# Altium schematic sheet EvoProject 1.0 - Entradas e Saídas.SchDoc
size A3
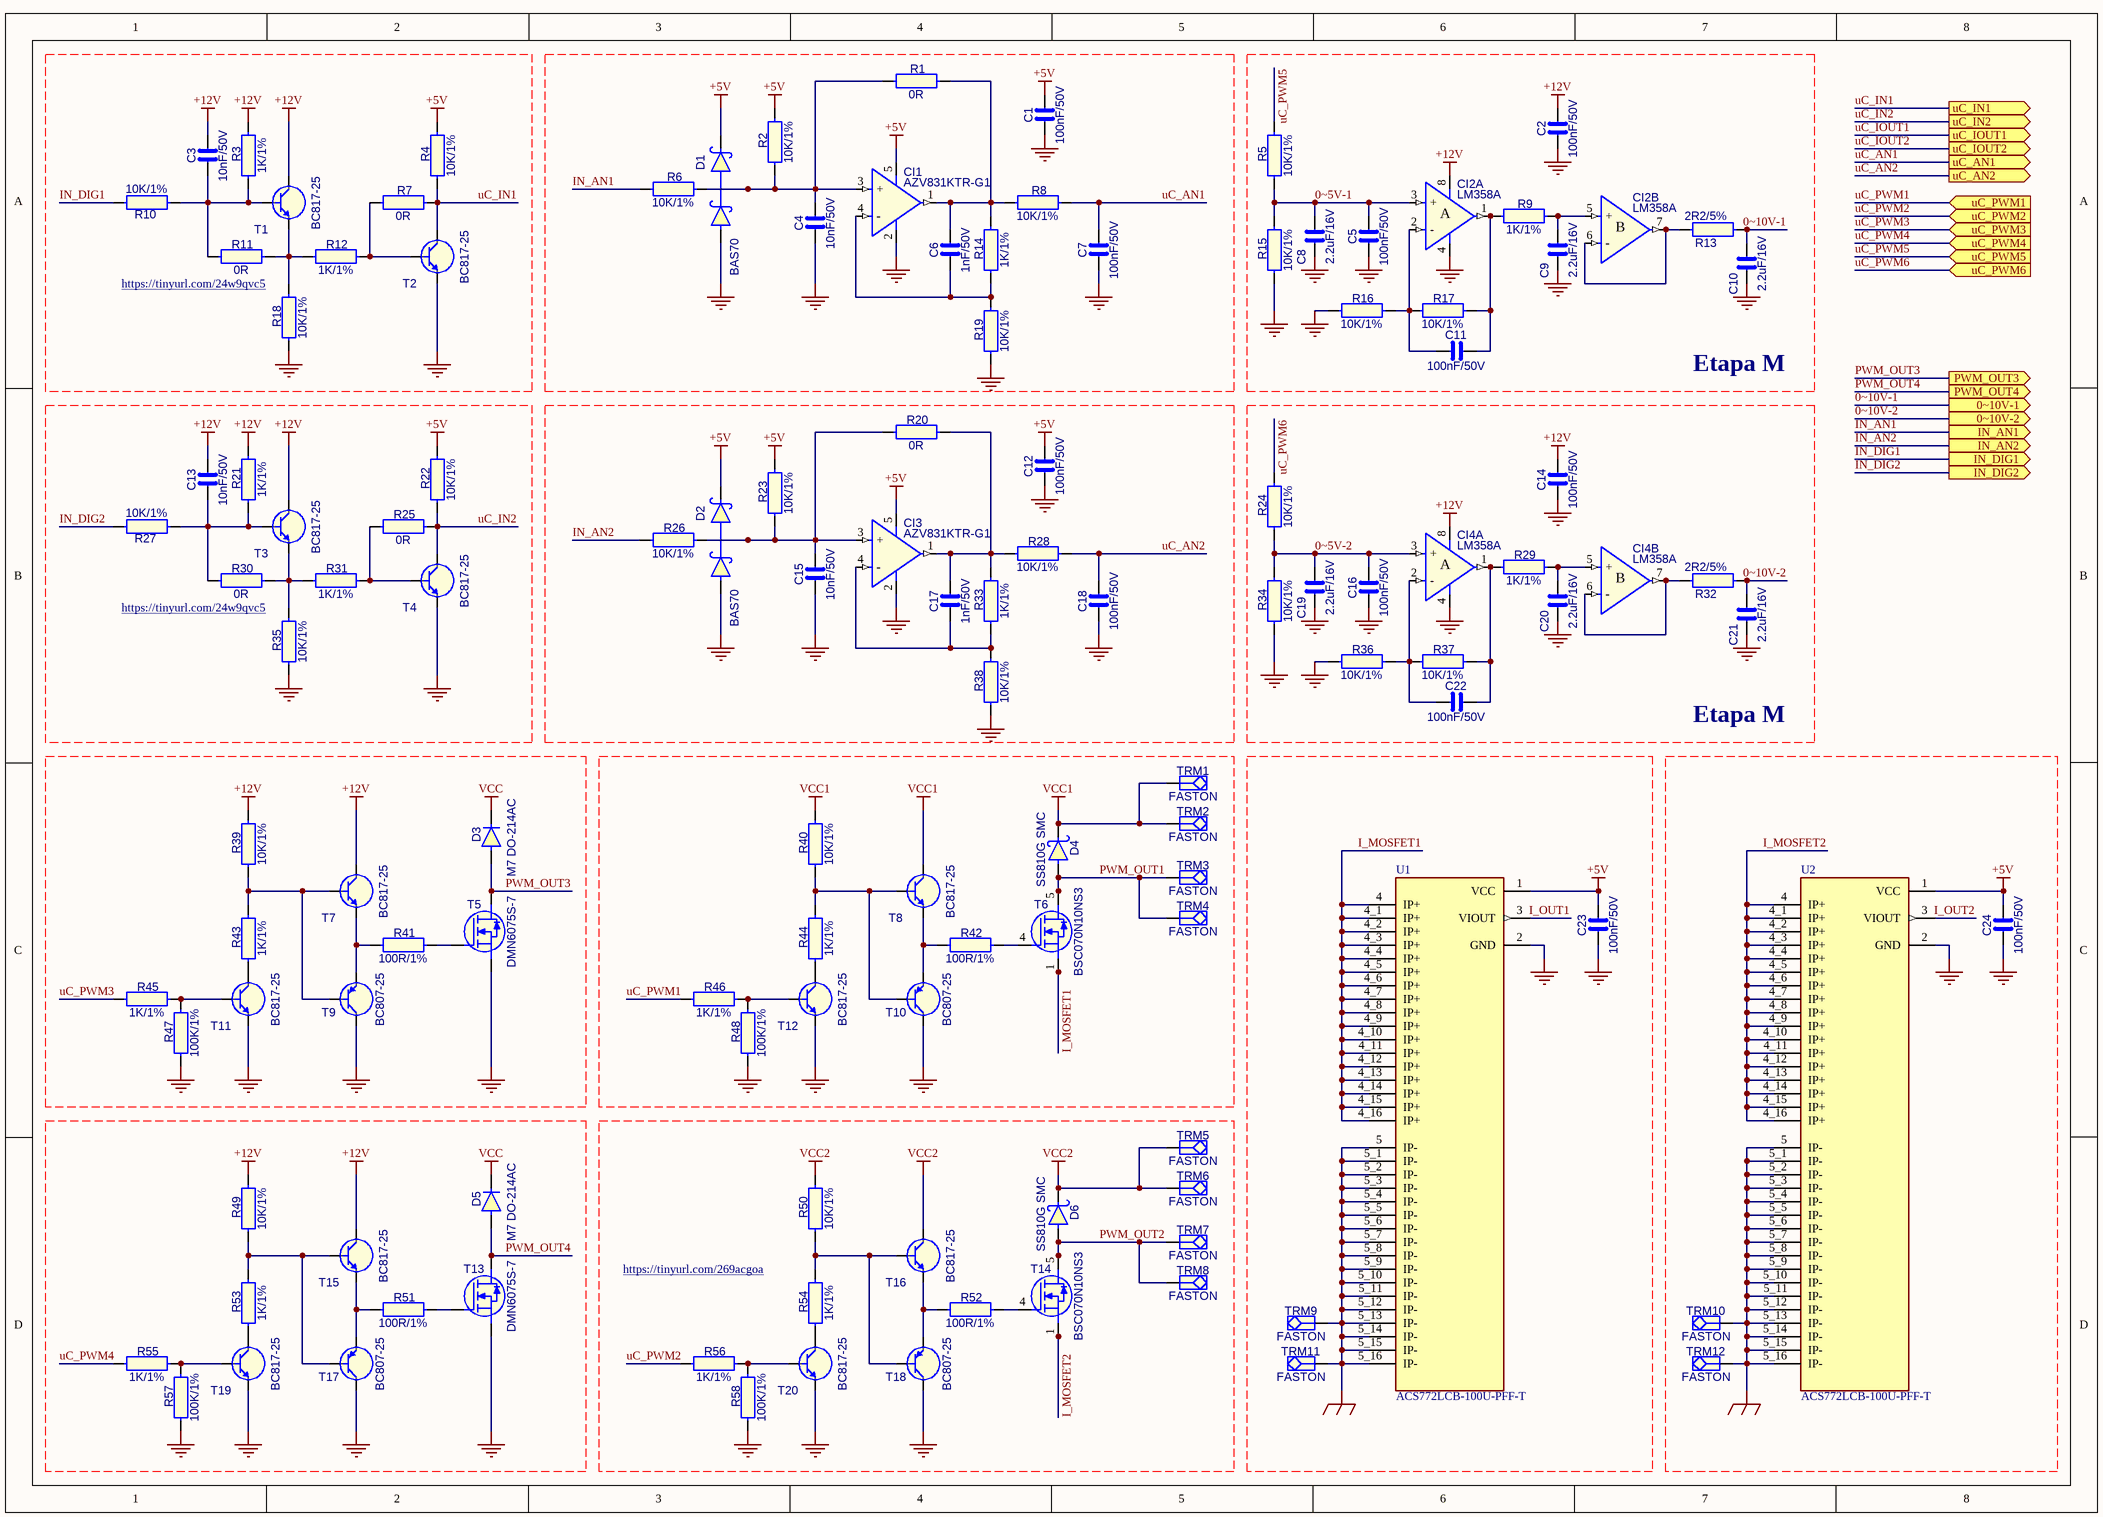
[diagram p0: EvoProject 1.0 - Entradas e Saídas.SchDoc]

## Parts
C1  100nF/50V  [CAP SMD CE 0603 HR]
C2  100nF/50V  [CAP SMD CE 0603 HR]
C3  10nF/50V  [CAP SMD CE 0603 HR]
C4  10nF/50V  [CAP SMD CE 0603 HR]
C5  100nF/50V  [CAP SMD CE 0603 HR]
C6  1nF/50V  [CAP SMD CE 0603 HR]
C7  100nF/50V  [CAP SMD CE 0603 HR]
C8  2.2uF/16V  [CAP SMD CE 0603 HR]
C9  2.2uF/16V  [CAP SMD CE 0603 HR]
C10  2.2uF/16V  [CAP SMD CE 0603 HR]
C11  100nF/50V  [CAP SMD CE 0603 HR]
C12  100nF/50V  [CAP SMD CE 0603 HR]
C13  10nF/50V  [CAP SMD CE 0603 HR]
C14  100nF/50V  [CAP SMD CE 0603 HR]
C15  10nF/50V  [CAP SMD CE 0603 HR]
C16  100nF/50V  [CAP SMD CE 0603 HR]
C17  1nF/50V  [CAP SMD CE 0603 HR]
C18  100nF/50V  [CAP SMD CE 0603 HR]
C19  2.2uF/16V  [CAP SMD CE 0603 HR]
C20  2.2uF/16V  [CAP SMD CE 0603 HR]
C21  2.2uF/16V  [CAP SMD CE 0603 HR]
C22  100nF/50V  [CAP SMD CE 0603 HR]
C23  100nF/50V  [CAP SMD CE 0603 HR]
C24  100nF/50V  [CAP SMD CE 0603 HR]
CI1  AZV831KTR-G1  [GEN SMD SOT23-5 MR]
CI2  LM358A  [GEN SMD SOIC8 P.1,27 MR]  (parts A,B of 2)
CI3  AZV831KTR-G1  [GEN SMD SOT23-5 MR]
CI4  LM358A  [GEN SMD SOIC8 P.1,27 MR]  (parts A,B of 2)
D1  BAS70  [GEN SMD SOT23-3 TO-236AA MR]
D2  BAS70  [GEN SMD SOT23-3 TO-236AA MR]
D3  M7 DO-214AC  [DIO SMD SMA DO214AC MR]
D4  SS810G SMC  [DIO SMD SMC DO214AB HR]
D5  M7 DO-214AC  [DIO SMD SMA DO214AC MR]
D6  SS810G SMC  [DIO SMD SMC DO214AB HR]
R1  0R  [RES SMD CH 0603 HR]
R2  10K/1%  [RES SMD CH 0603 HR]
R3  1K/1%  [RES SMD CH 0603 HR]
R4  10K/1%  [RES SMD CH 0603 HR]
R5  10K/1%  [RES SMD CH 0603 HR]
R6  10K/1%  [RES SMD CH 0603 HR]
R7  0R  [RES SMD CH 0603 HR]
R8  10K/1%  [RES SMD CH 0603 HR]
R9  1K/1%  [RES SMD CH 0603 HR]
R10  10K/1%  [RES SMD CH 0603 HR]
R11  0R  [RES SMD CH 0603 HR]
R12  1K/1%  [RES SMD CH 0603 HR]
R13  2R2/5%  [RES SMD CH 0603 HR]
R14  1K/1%  [RES SMD CH 0603 HR]
R15  10K/1%  [RES SMD CH 0603 HR]
R16  10K/1%  [RES SMD CH 0603 HR]
R17  10K/1%  [RES SMD CH 0603 HR]
R18  10K/1%  [RES SMD CH 0603 HR]
R19  10K/1%  [RES SMD CH 0603 HR]
R20  0R  [RES SMD CH 0603 HR]
R21  1K/1%  [RES SMD CH 0603 HR]
R22  10K/1%  [RES SMD CH 0603 HR]
R23  10K/1%  [RES SMD CH 0603 HR]
R24  10K/1%  [RES SMD CH 0603 HR]
R25  0R  [RES SMD CH 0603 HR]
R26  10K/1%  [RES SMD CH 0603 HR]
R27  10K/1%  [RES SMD CH 0603 HR]
R28  10K/1%  [RES SMD CH 0603 HR]
R29  1K/1%  [RES SMD CH 0603 HR]
R30  0R  [RES SMD CH 0603 HR]
R31  1K/1%  [RES SMD CH 0603 HR]
R32  2R2/5%  [RES SMD CH 0603 HR]
R33  1K/1%  [RES SMD CH 0603 HR]
R34  10K/1%  [RES SMD CH 0603 HR]
R35  10K/1%  [RES SMD CH 0603 HR]
R36  10K/1%  [RES SMD CH 0603 HR]
R37  10K/1%  [RES SMD CH 0603 HR]
R38  10K/1%  [RES SMD CH 0603 HR]
R39  10K/1%  [RES SMD CH 0603 HR]
R40  10K/1%  [RES SMD CH 0603 HR]
R41  100R/1%  [RES SMD CH 0603 HR]
R42  100R/1%  [RES SMD CH 0603 HR]
R43  1K/1%  [RES SMD CH 0603 HR]
R44  1K/1%  [RES SMD CH 0603 HR]
R45  1K/1%  [RES SMD CH 0603 HR]
R46  1K/1%  [RES SMD CH 0603 HR]
R47  100K/1%  [RES SMD CH 0603 HR]
R48  100K/1%  [RES SMD CH 0603 HR]
R49  10K/1%  [RES SMD CH 0603 HR]
R50  10K/1%  [RES SMD CH 0603 HR]
R51  100R/1%  [RES SMD CH 0603 HR]
R52  100R/1%  [RES SMD CH 0603 HR]
R53  1K/1%  [RES SMD CH 0603 HR]
R54  1K/1%  [RES SMD CH 0603 HR]
R55  1K/1%  [RES SMD CH 0603 HR]
R56  1K/1%  [RES SMD CH 0603 HR]
R57  100K/1%  [RES SMD CH 0603 HR]
R58  100K/1%  [RES SMD CH 0603 HR]
T1  BC817-25  [GEN SMD SOT23-3 TO-236AA MR]
T2  BC817-25  [GEN SMD SOT23-3 TO-236AA MR]
T3  BC817-25  [GEN SMD SOT23-3 TO-236AA MR]
T4  BC817-25  [GEN SMD SOT23-3 TO-236AA MR]
T5  DMN6075S-7  [GEN SMD SOT23-3 TO-236AA HR]
T6  BSC070N10NS3  [GEN SMD PG-TDSON-8 MR]
T7  BC817-25  [GEN SMD SOT23-3 TO-236AA MR]
T8  BC817-25  [GEN SMD SOT23-3 TO-236AA MR]
T9  BC807-25  [GEN SMD SOT23-3 TO-236AA MR]
T10  BC807-25  [GEN SMD SOT23-3 TO-236AA MR]
T11  BC817-25  [GEN SMD SOT23-3 TO-236AA MR]
T12  BC817-25  [GEN SMD SOT23-3 TO-236AA MR]
T13  DMN6075S-7  [GEN SMD SOT23-3 TO-236AA HR]
T14  BSC070N10NS3  [GEN SMD PG-TDSON-8 MR]
T15  BC817-25  [GEN SMD SOT23-3 TO-236AA MR]
T16  BC817-25  [GEN SMD SOT23-3 TO-236AA MR]
T17  BC807-25  [GEN SMD SOT23-3 TO-236AA MR]
T18  BC807-25  [GEN SMD SOT23-3 TO-236AA MR]
T19  BC817-25  [GEN SMD SOT23-3 TO-236AA MR]
T20  BC817-25  [GEN SMD SOT23-3 TO-236AA MR]
TRM1  FASTON  [Terminal Faston Macho 180° OBLONGO COM SUPORTE]
TRM2  FASTON  [Terminal Faston Macho 180° OBLONGO COM SUPORTE]
TRM3  FASTON  [Terminal Faston Macho 180° OBLONGO COM SUPORTE]
TRM4  FASTON  [Terminal Faston Macho 180° OBLONGO COM SUPORTE]
TRM5  FASTON  [Terminal Faston Macho 180° OBLONGO COM SUPORTE]
TRM6  FASTON  [Terminal Faston Macho 180° OBLONGO COM SUPORTE]
TRM7  FASTON  [Terminal Faston Macho 180° OBLONGO COM SUPORTE]
TRM8  FASTON  [Terminal Faston Macho 180° OBLONGO COM SUPORTE]
TRM9  FASTON  [Terminal Faston Macho 180° OBLONGO COM SUPORTE]
TRM10  FASTON  [Terminal Faston Macho 180° OBLONGO COM SUPORTE]
TRM11  FASTON  [Terminal Faston Macho 180° OBLONGO COM SUPORTE]
TRM12  FASTON  [Terminal Faston Macho 180° OBLONGO COM SUPORTE]
U1  ACS772LCB-100U-PFF-T  [XDCR_ACS772LCB-100U-PFF-T]
U2  ACS772LCB-100U-PFF-T  [XDCR_ACS772LCB-100U-PFF-T]

## Ports
0~10V-1 (out), 0~10V-2 (out), IN_AN1 (out), IN_AN2 (out), IN_DIG1 (out), IN_DIG2 (out), PWM_OUT3 (out), PWM_OUT4 (out), uC_AN1 (out), uC_AN2 (out), uC_IN1 (out), uC_IN2 (out), uC_IOUT1 (out), uC_IOUT2 (out), uC_PWM1 (in), uC_PWM2 (in), uC_PWM3 (in), uC_PWM4 (in), uC_PWM5 (in), uC_PWM6 (in)

## Nets
+5V: C1.1 C12.1 C23.1 C24.1 CI1.5(VCC) CI3.5(VCC) D1.2(K) D2.2(K) R2.2 R4.2 R22.2 R23.2 U1.1(VCC) U2.1(VCC)
+12V: C2.1 C3.1 C13.1 C14.1 CI2.8(VCC) CI4.8(VCC) R3.2 R21.2 R39.2 R49.2 T1.3(C) T3.3(C) T7.3(C) T15.3(C)
GND: C1.2 C2.2 C4.2 C5.2 C7.2 C8.2 C9.2 C10.2 C12.2 C14.2 C15.2 C16.2 C18.2 C19.2 C20.2 C21.2 C23.2 C24.2 CI1.2(GND) CI2.4(GND) CI3.2(GND) CI4.4(GND) D1.1(A) D2.1(A) R15.1 R16.1 R18.1 R19.1 R34.1 R35.1 R36.1 R38.1 R47.1 R48.1 R57.1 R58.1 T2.2(E) T4.2(E) T5.2(S) T9.3(C) T10.3(C) T11.2(E) T12.2(E) T13.2(S) T17.3(C) T18.3(C) T19.2(E) T20.2(E) U1.2(GND) U2.2(GND)
power_GND1: TRM9.1 TRM11.1 U1.5(IP-) U1.5_1(IP-) U1.5_2(IP-) U1.5_3(IP-) U1.5_4(IP-) U1.5_5(IP-) U1.5_6(IP-) U1.5_7(IP-) U1.5_8(IP-) U1.5_9(IP-) U1.5_10(IP-) U1.5_11(IP-) U1.5_12(IP-) U1.5_13(IP-) U1.5_14(IP-) U1.5_15(IP-) U1.5_16(IP-)
power_GND2: TRM10.1 TRM12.1 U2.5(IP-) U2.5_1(IP-) U2.5_2(IP-) U2.5_3(IP-) U2.5_4(IP-) U2.5_5(IP-) U2.5_6(IP-) U2.5_7(IP-) U2.5_8(IP-) U2.5_9(IP-) U2.5_10(IP-) U2.5_11(IP-) U2.5_12(IP-) U2.5_13(IP-) U2.5_14(IP-) U2.5_15(IP-) U2.5_16(IP-)
VCC: D3.1(K) D5.1(K)
VCC1: D4.1(K) R40.2 T8.3(C) TRM1.1 TRM2.1
VCC2: D6.1(K) R50.2 T16.3(C) TRM5.1 TRM6.1
0~5V-1: C5.1 C8.1 CI2.3(+) R5.1 R15.2
0~5V-2: C16.1 C19.1 CI4.3(+) R24.1 R34.2
0~10V-1: C10.1 R13.1 ; port 0~10V-1
0~10V-2: C21.1 R32.1 ; port 0~10V-2
I_MOSFET1: T6.1(S) T6.2(S) T6.3(S) U1.4(IP+) U1.4_1(IP+) U1.4_2(IP+) U1.4_3(IP+) U1.4_4(IP+) U1.4_5(IP+) U1.4_6(IP+) U1.4_7(IP+) U1.4_8(IP+) U1.4_9(IP+) U1.4_10(IP+) U1.4_11(IP+) U1.4_12(IP+) U1.4_13(IP+) U1.4_14(IP+) U1.4_15(IP+) U1.4_16(IP+)
I_MOSFET2: T14.1(S) T14.2(S) T14.3(S) U2.4(IP+) U2.4_1(IP+) U2.4_2(IP+) U2.4_3(IP+) U2.4_4(IP+) U2.4_5(IP+) U2.4_6(IP+) U2.4_7(IP+) U2.4_8(IP+) U2.4_9(IP+) U2.4_10(IP+) U2.4_11(IP+) U2.4_12(IP+) U2.4_13(IP+) U2.4_14(IP+) U2.4_15(IP+) U2.4_16(IP+)
I_OUT1: U1.3(VIOUT)
I_OUT2: U2.3(VIOUT)
IN_AN1: R6.1 ; port IN_AN1
IN_AN2: R26.1 ; port IN_AN2
IN_DIG1: R10.2 ; port IN_DIG1
IN_DIG2: R27.2 ; port IN_DIG2
PWM_OUT1: D4.2(A) T6.5(D) T6.6(D) T6.7(D) T6.8(D) TRM3.1 TRM4.1
PWM_OUT2: D6.2(A) T14.5(D) T14.6(D) T14.7(D) T14.8(D) TRM7.1 TRM8.1
PWM_OUT3: D3.2(A) T5.3(D) ; port PWM_OUT3
PWM_OUT4: D5.2(A) T13.3(D) ; port PWM_OUT4
uC_AN1: C7.1 R8.2 ; port uC_AN1
uC_AN2: C18.1 R28.2 ; port uC_AN2
uC_IN1: R4.1 R7.2 T2.3(C) ; port uC_IN1
uC_IN2: R22.1 R25.2 T4.3(C) ; port uC_IN2
uC_IOUT1: port uC_IOUT1
uC_IOUT2: port uC_IOUT2
uC_PWM1: R46.1 ; port uC_PWM1
uC_PWM2: R56.1 ; port uC_PWM2
uC_PWM3: R45.1 ; port uC_PWM3
uC_PWM4: R55.1 ; port uC_PWM4
uC_PWM5: R5.2 ; port uC_PWM5
uC_PWM6: R24.2 ; port uC_PWM6
NetC3_2: C3.2 R3.1 R10.1 R11.1 T1.1(B)
NetC4_1: C4.1 CI1.3(+) D1.3(K/A) R1.1 R2.1 R6.2
NetC6_1: C6.1 CI1.1(OUT) R1.2 R8.1 R14.2
NetC6_2: C6.2 CI1.4(-) R14.1 R19.2
NetC9_1: C9.1 CI2.5(+) R9.2
NetC11_1: C11.1 CI2.1(OUT) R9.1 R17.2
NetC11_2: C11.2 CI2.2(-) R16.2 R17.1
NetC13_2: C13.2 R21.1 R27.1 R30.1 T3.1(B)
NetC15_1: C15.1 CI3.3(+) D2.3(K/A) R20.1 R23.1 R26.2
NetC17_1: C17.1 CI3.1(OUT) R20.2 R28.1 R33.2
NetC17_2: C17.2 CI3.4(-) R33.1 R38.2
NetC20_1: C20.1 CI4.5(+) R29.2
NetC22_1: C22.1 CI4.1(OUT) R29.1 R37.2
NetC22_2: C22.2 CI4.2(-) R36.2 R37.1
NetCI2_6: CI2.6(-) CI2.7(OUT) R13.2
NetCI4_6: CI4.6(-) CI4.7(OUT) R32.2
NetR7_1: R7.1 R12.2 T2.1(B)
NetR11_2: R11.2 R12.1 R18.2 T1.2(E)
NetR25_1: R25.1 R31.2 T4.1(B)
NetR30_2: R30.2 R31.1 R35.2 T3.2(E)
NetR39_1: R39.1 R43.2 T7.1(B) T9.1(B)
NetR40_1: R40.1 R44.2 T8.1(B) T10.1(B)
NetR41_1: R41.1 T7.2(E) T9.2(E)
NetR41_2: R41.2 T5.1(G)
NetR42_1: R42.1 T8.2(E) T10.2(E)
NetR42_2: R42.2 T6.4(G)
NetR43_1: R43.1 T11.3(C)
NetR44_1: R44.1 T12.3(C)
NetR45_2: R45.2 R47.2 T11.1(B)
NetR46_2: R46.2 R48.2 T12.1(B)
NetR49_1: R49.1 R53.2 T15.1(B) T17.1(B)
NetR50_1: R50.1 R54.2 T16.1(B) T18.1(B)
NetR51_1: R51.1 T15.2(E) T17.2(E)
NetR51_2: R51.2 T13.1(G)
NetR52_1: R52.1 T16.2(E) T18.2(E)
NetR52_2: R52.2 T14.4(G)
NetR53_1: R53.1 T19.3(C)
NetR54_1: R54.1 T20.3(C)
NetR55_2: R55.2 R57.2 T19.1(B)
NetR56_2: R56.2 R58.2 T20.1(B)

## Notes on the sheet
- (near R18) https://tinyurl.com/24w9qvc5
- Etapa M
- (near R35) https://tinyurl.com/24w9qvc5
- https://tinyurl.com/269acgoa
- Modelo:
- Formato:
- Criado:
- A3
- Responsável:
- Alterado:
- Revisão:
- Página:
- de
- Arquivo:
- Versão:
- (in symbol CMPL-001-0751-2, part A) A
- (in symbol CMPL-001-0751-2, part B) B

## Library data of the parts
C1 C2 C5 C7 C11 C12 C14 C16 C18 C22-C24 = CMPL-001-0040-11: CAPACITOR SMD CE 0603 100nF 50V 10% X7R; Manufacturer 1: SAMSUNG; Part Number 1: CL10B104KB8NNNC; ERP: 5845; Supplier 1: FUTURE ELECTRONICS CORP.; HC 1: N/A; Supplier 2: AVNET ELECTRONICS MARKETING; Montagem: SMD; Package: N/A; HC 2: N/A; Status: 1 - LIBERADO; Manufacturer 2: SAMSUNG ELECTRONICS; Part Number 2: CL10B104KB8NNNC
C3 C4 C13 C15 = CMPL-001-0052-11: CAPACITOR SMD CE 0603 10nF 50V 20% X7R; Part Number 1: CL10B103KB8NNNC; Manufacturer 1: SAMSUNG; ERP: 5850; Supplier 1: ARROW COMPONENTS MEXICO S.A. DE C.V.; Status: 1 - LIBERADO; Montagem: SMD; HC 2: N/A; Package: N/A; Part Number 2: CL10B103KB8NNNC; HC 1: N/A; Manufacturer 2: SAMSUNG; Supplier 2: ARROW ELECTRONICS,INC.
C6 C17 = CMPL-001-0068-11: CAPACITOR SMD CE 0603 1nF 50V 10% X7R; Part Number 1: CL10B102KB8NNNC; Manufacturer 1: SAMSUNG; ERP: 5846; Status: 1 - LIBERADO; Supplier 2: ARROW ELECTRONICS,INC.; Manufacturer 2: SAMSUNG; HC 1: N/A; Package: N/A; Part Number 2: CL10B102KB8NNNC; Supplier 1: ARROW COMPONENTS MEXICO S.A. DE C.V.; Montagem: SMD; HC 2: N/A
C8-C10 C19-C21 = CMPL-001-0077-11: CAPACITOR SMD CE 0603 2,2uF 16V 10% X5R; Manufacturer 1: SAMSUNG; Part Number 1: CL10A225KO8NNNC; ERP: 5849; HC 1: N/A; HC 2: N/A; Manufacturer 2: MURATA ELECTRONICS; Montagem: SMD; Package: N/A; Part Number 2: GRM188R61C225KE15D; Status: 1 - LIBERADO; Supplier 1: FUTURE ELECTRONICS CORP.; Supplier 2: AVNET ELECTRONICS MARKETING
CI1 CI3 = CMPL-001-0140-3: CI OP AZV831KTR-G1; Manufacturer 1: DIODES; ERP: 6623; HC 1: N/A; HC 2: N/A; Manufacturer 2: N/A; Package: N/A; Part Number 1: AZV831KTR-G1; Part Number 2: N/A; Supplier 1: FUTURE ELECTRONICS CORP.; Supplier 2: N/A
CI2 CI4 = CMPL-001-0751-2: CI SMD LM 358; Manufacturer 1: Fairchild Semiconductor; Part Number 1: LM358AMX; ERP: 6590; HC 1: N/A; HC 2: N/A; Manufacturer 2: ON SEMICONDUCTOR; Package: N/A; Part Number 2: LM358ADR2G; Supplier 1: ARROW ELECTRONICS,INC.; Supplier 2: CLASSIC COMPONENTS CORPORATION
D1 D2 = CMPL-001-0495-3: DIODO SMD SCH SOT-23 70V 100mA; Manufacturer 1: HOTTECH; Part Number 1: BAS70-04 SOT-23; ERP: 14173; Supplier 1: HOTTECH SEMICONDUCTOR TECHNOLOGY (HK) LTDA
D3 D5 = CMPL-001-0897-1: DIODO SMD 1N4007 SMA; Manufacturer 1: HOTTECH; ERP: 3583; HC 1: N/A; HC 2: N/A; Manufacturer 2: LGE; Package: N/A; Part Number 1: M7 DO-214AC; Part Number 2: M7 SMA; Supplier 1: HOTTECH SEMICONDUCTOR TECHNOLOGY (HK) LTDA; Supplier 2: NEW TECK EXPORTADORA E IMPORTADORA LTDA
D4 D6 = CMPL-001-0912-3: DIODO SCHOTTKY SK810 SMD; Manufacturer 1: HOTTECH; ERP: 3624; Custo médio (R$): 0,32953; Custo padrão (R$): 0,3003; Datasheet 1: N/A; Datasheet 2: N/A; HC 1: N/A; HC 2: N/A; Manufacturer 2: N/A; Montagem: SMD; Package: N/A; Part Number 1: SS810G SMC; Part Number 2: N/A; Supplier 1: HOTTECH SEMICONDUCTOR TECHNOLOGY (HK) LTDA; Supplier 2: N/A
R1 R7 R11 R20 R25 R30 = CMPL-001-0300-5: RESISTOR SMD CH 0603 0R JMP 1/10W; Manufacturer 1: HOTTECH; Part Number 1: RI0603L000JT; ERP: 4418; HC 2: N/A; Part Number 2: 0603WAJ0000T5E; Supplier 2: ROYAL ELETRONIC FACTORY(THAILAND)CO.,LTD; HC 1: N/A; Supplier 1: HOTTECH SEMICONDUCTOR TECHNOLOGY (HK) LTDA; Package: N/A; Manufacturer 2: ROYAL ELETRONICS
R2 R4-R6 R8 R10 R15-R19 R22-R24 R26-R28 R34-R40 R49 R50 = CMPL-001-0308-5: RESISTOR SMD CH 0603 10K 1% 1/10W; Part Number 1: RI0603L1002FT; Manufacturer 1: HOTTECH; ERP: 4426; Part Number 2: RC0603FR-0710KL; Supplier 1: HOTTECH SEMICONDUCTOR TECHNOLOGY (HK) LTDA; Package: N/A; Supplier 2: SOLUCAO COMERCIO DE COMP ELE LTDA EPP; HC 2: N/A; HC 1: N/A; Manufacturer 2: YAGEO
R3 R9 R12 R14 R21 R29 R31 R33 R43-R46 R53-R56 = CMPL-001-0339-5: RESISTOR SMD CH 0603 1K 1% 1/10W; Manufacturer 1: HOTTECH; Part Number 1: RI0603L1001FT; ERP: 4459; Package: N/A; HC 1: N/A; Supplier 1: HOTTECH SEMICONDUCTOR TECHNOLOGY (HK) LTDA; Part Number 2: RC0603FR-071KL; Manufacturer 2: YAGEO; HC 2: N/A; Supplier 2: SOLUCAO COMERCIO DE COMP ELE LTDA EPP
R13 R32 = CMPL-001-0317-5: RESISTOR SMD CH 0603 2R2 5% 1/10W; Manufacturer 1: HOTTECH; Part Number 1: RI0603L2R2JT; ERP: 4435; HC 1: N/A; HC 2: N/A; Manufacturer 2: ROYAL OHM; Package: N/A; Part Number 2: 0603WAJ022JT5E; Supplier 1: HOTTECH SEMICONDUCTOR TECHNOLOGY (HK) LTDA; Supplier 2: WKS TECHNOLOGY DO BRASIL LTDA
R41 R42 R51 R52 = CMPL-001-0411-4: RESISTOR SMD CH 0603 100R 1% 1/10W; Manufacturer 1: HOTTECH; Part Number 1: RI0603L1000FT; ERP: 9984; Manufacturer 2: ROYALOHM; Supplier 2: WKS TECHNOLOGY DO BRASIL LTDA; Part Number 2: 0603WAF1000T5E; HC 2: N/A; Package: N/A; HC 1: N/A; Supplier 1: HOTTECH SEMICONDUCTOR TECHNOLOGY (HK) LTDA
R47 R48 R57 R58 = CMPL-001-0354-5: RESISTOR SMD CH 0603 100K 1% 1/10W; Part Number 1: RI0603L1003FT; Manufacturer 1: HOTTECH; ERP: 4486; Supplier 2: N/A; Manufacturer 2: N/A; Part Number 2: N/A; Package: N/A; Supplier 1: HOTTECH SEMICONDUCTOR TECHNOLOGY (HK) LTDA; HC 1: N/A; HC 2: N/A
T1-T4 T7 T8 T11 T12 T15 T16 T19 T20 = CMPL-001-0444-6: TRANSISTOR SMD 817/25; Manufacturer 1: NEXPERIA (NXP); ERP: 5923; Custo médio (R$): 0.03943; Custo padrão (R$): 0.0344; Datasheet 1: N/A; Datasheet 2: N/A; HC 1: N/A; HC 2: N/A; Manufacturer 2: N/A; Package: N/A; Part Number 1: BC817-25; Part Number 2: N/A; Supplier 1: FUTURE ELECTRONICS CORP.; Supplier 2: N/A
T5 T13 = CMPL-001-0512-6: TRANSISTOR MOSFET DMN6075S SMD; Manufacturer 1: DIODES INC.; ERP: 5968; HC 1: N/A; Package: N/A; Part Number 2: UT3N06G SOT-23 T/R; Supplier 1: AVNET ELECTRONICS MARKETING; Part Number 1: DMN6075S-7; Manufacturer 2: UTC; HC 2: N/A; Supplier 2: L4B1 COMERCIAL E IMPORTADORA LTDA
T6 T14 = CMPL-001-0663-7: MOSFET SMD N-CH TDSON-8 100V 90A 114W 7mOhm; ERP: 5960; Montagem: SMD
T9 T10 T17 T18 = CMPL-001-0445-7: TRANSISTOR SMD 807/25; Manufacturer 1: NEXPERIA (NXP); ERP: 5924; Custo médio (R$): 0.03768; Custo padrão (R$): 0.0355; Datasheet 1: N/A; Datasheet 2: N/A; HC 1: N/A; HC 2: N/A; Manufacturer 2: N/A; Package: N/A; Part Number 1: BC807-25; Part Number 2: N/A; Supplier 1: FUTURE ELECTRONICS CORP.; Supplier 2: N/A
TRM1-TRM12 = CMPL-001-0475-2: TERMINAL P/ PCI 180° 6,35mmX14,2mm BAIONETA; ERP: 22116
U1 U2 = ACS772LCB-100U-PFF-T: Current Sensor 100A 1 Channel Hall Effect Unidirectional 5-CB Formed Leads, PFF; MF: Allegro MicroSystems LLC; SnapEDA_Link: https://www.snapeda.com/parts/ACS772LCB-100U-PFF-T/Allegro/view-part/?ref=snap; Package: 5-CB-5 Allegro MicroSystems LLC; Value: *; MP: ACS772LCB-100U-PFF-T